# EAGLE design clock (EAGLE 7.3.0)
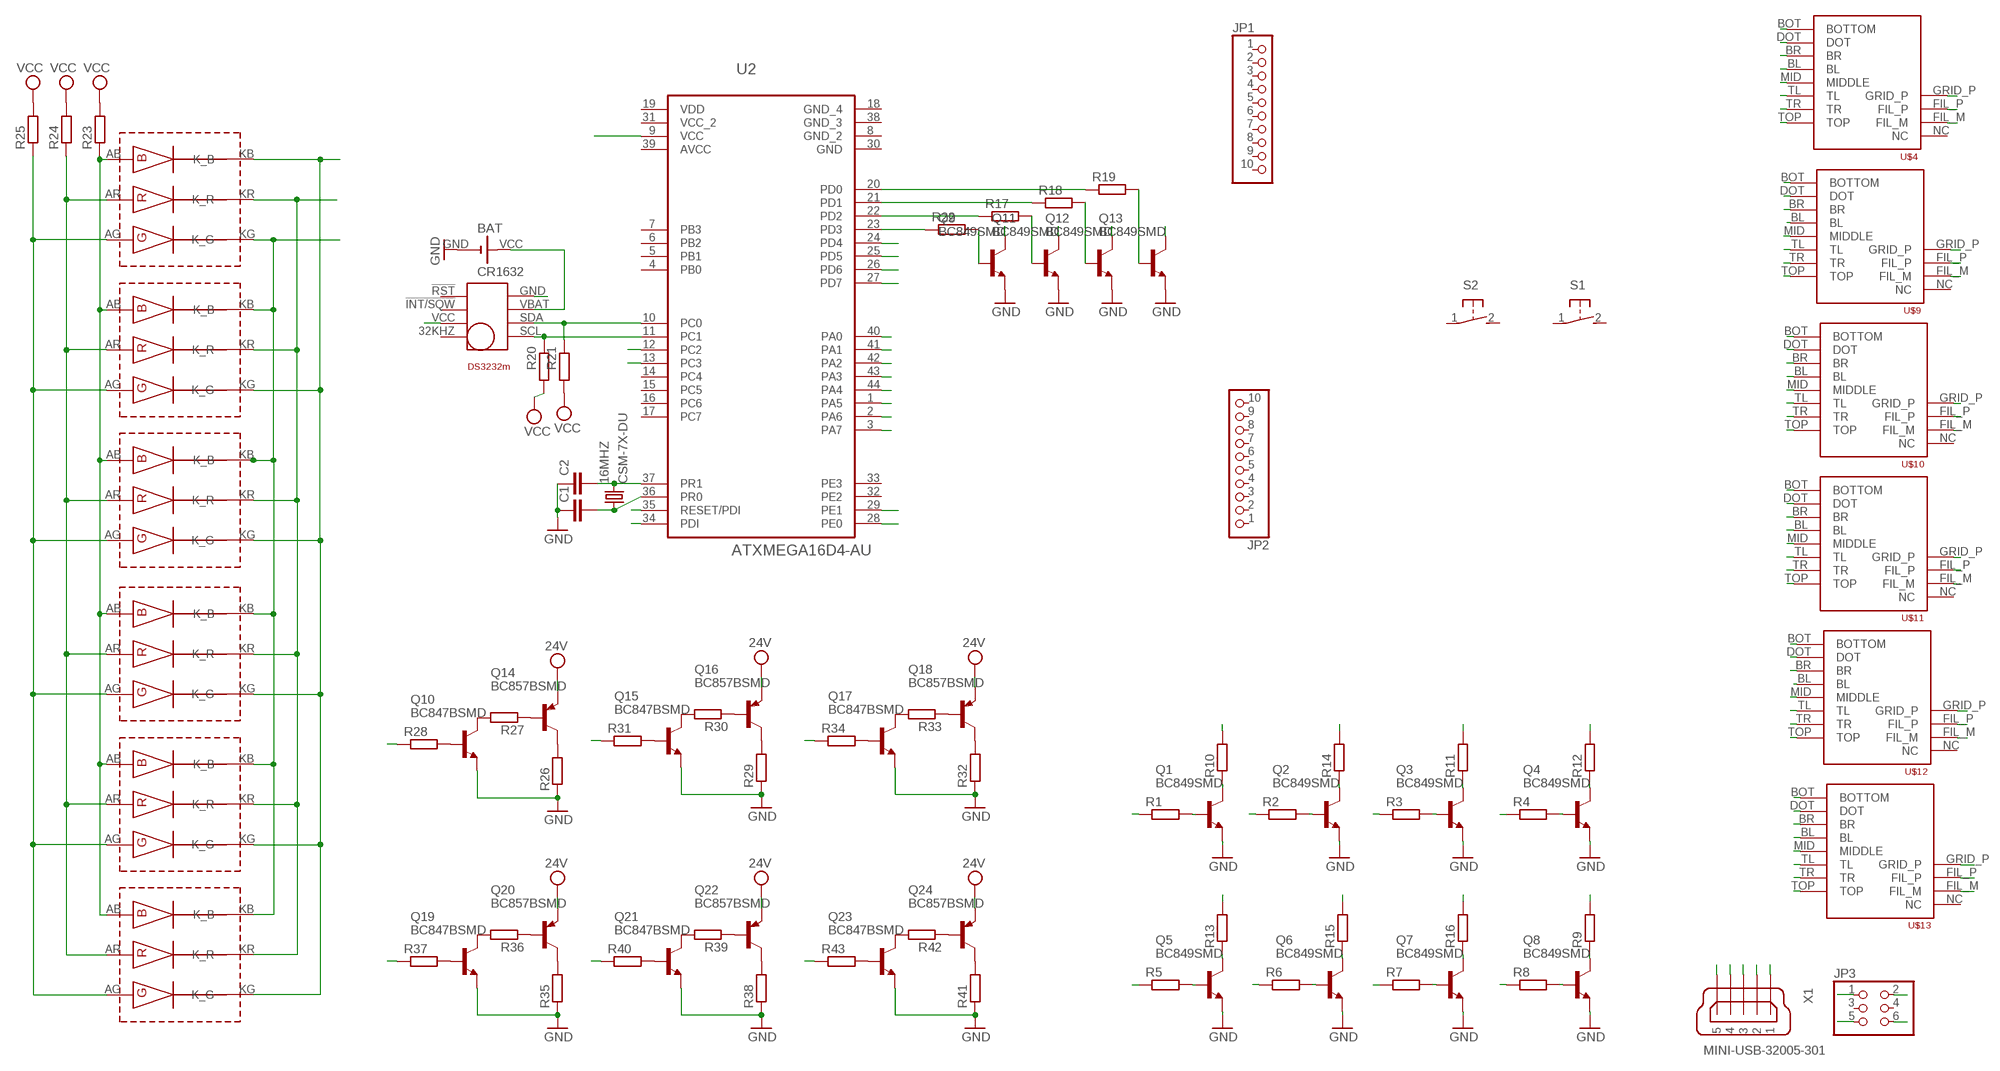
[diagram p0: schematic, sheet 1]

## Parts
16MHZ  CSM-7X-DU  [CSM-7X-DU]
BAT  CR1632  [CR3232]
C1  C-EUC0805K  [C0805K]
C2  C-EUC0805K  [C0805K]
JP1  PINHD-1X10  [1X10]
JP2  PINHD-1X10  [1X10]
JP3  PINHD-2X3/90  [2X03/90]
Q1  BC849SMD  [SOT23-BEC]
Q2  BC849SMD  [SOT23-BEC]
Q3  BC849SMD  [SOT23-BEC]
Q4  BC849SMD  [SOT23-BEC]
Q5  BC849SMD  [SOT23-BEC]
Q6  BC849SMD  [SOT23-BEC]
Q7  BC849SMD  [SOT23-BEC]
Q8  BC849SMD  [SOT23-BEC]
Q9  BC849SMD  [SOT23-BEC]
Q10  BC847BSMD  [SOT23]
Q11  BC849SMD  [SOT23-BEC]
Q12  BC849SMD  [SOT23-BEC]
Q13  BC849SMD  [SOT23-BEC]
Q14  BC857BSMD  [SOT23-BEC]
Q15  BC847BSMD  [SOT23]
Q16  BC857BSMD  [SOT23-BEC]
Q17  BC847BSMD  [SOT23]
Q18  BC857BSMD  [SOT23-BEC]
Q19  BC847BSMD  [SOT23]
Q20  BC857BSMD  [SOT23-BEC]
Q21  BC847BSMD  [SOT23]
Q22  BC857BSMD  [SOT23-BEC]
Q23  BC847BSMD  [SOT23]
Q24  BC857BSMD  [SOT23-BEC]
R1  R-EU_0207/10  [0207/10]
R2  R-EU_0207/10  [0207/10]
R3  R-EU_0207/10  [0207/10]
R4  R-EU_0207/10  [0207/10]
R5  R-EU_0207/10  [0207/10]
R6  R-EU_0207/10  [0207/10]
R7  R-EU_0207/10  [0207/10]
R8  R-EU_0207/10  [0207/10]
R9  R-EU_0207/10  [0207/10]
R10  R-EU_0207/10  [0207/10]
R11  R-EU_0207/10  [0207/10]
R12  R-EU_0207/10  [0207/10]
R13  R-EU_0207/10  [0207/10]
R14  R-EU_0207/10  [0207/10]
R15  R-EU_0207/10  [0207/10]
R16  R-EU_0207/10  [0207/10]
R17  R-EU_0207/10  [0207/10]
R18  R-EU_0207/10  [0207/10]
R19  R-EU_0207/10  [0207/10]
R20  R-EU_0207/10  [0207/10]
R21  R-EU_0207/10  [0207/10]
R22  R-EU_0207/10  [0207/10]
R23  R-EU_0207/10  [0207/10]
R24  R-EU_0207/10  [0207/10]
R25  R-EU_0207/10  [0207/10]
R26  R-EU_0207/10  [0207/10]
R27  R-EU_0207/10  [0207/10]
R28  R-EU_0207/10  [0207/10]
R29  R-EU_0207/10  [0207/10]
R30  R-EU_0207/10  [0207/10]
R31  R-EU_0207/10  [0207/10]
R32  R-EU_0207/10  [0207/10]
R33  R-EU_0207/10  [0207/10]
R34  R-EU_0207/10  [0207/10]
R35  R-EU_0207/10  [0207/10]
R36  R-EU_0207/10  [0207/10]
R37  R-EU_0207/10  [0207/10]
R38  R-EU_0207/10  [0207/10]
R39  R-EU_0207/10  [0207/10]
R40  R-EU_0207/10  [0207/10]
R41  R-EU_0207/10  [0207/10]
R42  R-EU_0207/10  [0207/10]
R43  R-EU_0207/10  [0207/10]
S1  31-XX  [B3F-31XX]
S2  31-XX  [B3F-31XX]
U2  ATXMEGA16D4-AU  [QFP80P1200X1200X120-44N]
U$1  RGB-SMT-SQUARE5X5MM  [SMT-SQUARE5]
U$2  DS3232M  [SOIC8]
U$3  RGB-SMT-SQUARE5X5MM  [SMT-SQUARE5]
U$4  IV6_NUMITRONLARGE  [IV6_NUMITRON_PAC_LARGE]
U$5  RGB-SMT-SQUARE5X5MM  [SMT-SQUARE5]
U$6  RGB-SMT-SQUARE5X5MM  [SMT-SQUARE5]
U$7  RGB-SMT-SQUARE5X5MM  [SMT-SQUARE5]
U$8  RGB-SMT-SQUARE5X5MM  [SMT-SQUARE5]
U$9  IV6_NUMITRONLARGE  [IV6_NUMITRON_PAC_LARGE]
U$10  IV6_NUMITRONLARGE  [IV6_NUMITRON_PAC_LARGE]
U$11  IV6_NUMITRONLARGE  [IV6_NUMITRON_PAC_LARGE]
U$12  IV6_NUMITRONLARGE  [IV6_NUMITRON_PAC_LARGE]
U$13  IV6_NUMITRONLARGE  [IV6_NUMITRON_PAC_LARGE]
X1  MINI-USB-32005-301  [32005-301]

## Nets
24V: Q14.E Q16.E Q18.E Q20.E Q22.E Q24.E
B: Q11.C U$1.KB(K_B) U$3.KG(K_G) U$5.KG(K_G) U$6.KG(K_G) U$7.KG(K_G) U$8.KG(K_G)
BL: U$4.BL U$9.BL U$10.BL U$11.BL U$12.BL U$13.BL
BOT: U$4.BOT(BOTTOM) U$9.BOT(BOTTOM) U$10.BOT(BOTTOM) U$11.BOT(BOTTOM) U$12.BOT(BOTTOM) U$13.BOT(BOTTOM)
BR: U$4.BR U$9.BR U$10.BR U$11.BR U$12.BR U$13.BR
DOT: U$4.DOT U$9.DOT U$10.DOT U$11.DOT U$12.DOT U$13.DOT
FIL_P: U$4.FIL_P U$9.FIL_P U$10.FIL_P U$11.FIL_P U$12.FIL_P U$13.FIL_P
FILL_MINUS: Q9.C
G: Q12.C U$1.KG(K_G) U$3.KB(K_B) U$5.KB(K_B) U$6.KB(K_B) U$7.KB(K_B) U$8.KB(K_B)
GND: BAT.GND(-) C1.1 C2.1 JP3.6 Q1.E Q2.E Q3.E Q4.E Q5.E Q6.E Q7.E Q8.E Q9.E Q10.2(E) Q11.E Q12.E Q13.E Q15.2(E) Q17.2(E) Q19.2(E) Q21.2(E) Q23.2(E) R26.1 R29.1 R32.1 R35.1 R38.1 R41.1 U$2.GND X1.1 X1.2
MID: U$4.MID(MIDDLE) U$9.MID(MIDDLE) U$10.MID(MIDDLE) U$11.MID(MIDDLE) U$12.MID(MIDDLE) U$13.MID(MIDDLE)
N$1: Q14.C R26.2
N$2: R10.2
N$3: Q14.B R27.1
N$4: Q16.C R29.2
N$5: 16MHZ.1 C1.2 U2.36(PR0)
N$6: R11.2
N$7: Q16.B R30.1
N$8: Q18.C R32.2
N$9: Q8.B R8.2
N$10: Q1.B R1.2
N$11: Q3.B R3.2
N$12: Q4.B R4.2
N$13: Q5.B R5.2
N$14: Q2.B R2.2
N$15: Q6.B R6.2
N$16: Q7.B R7.2
N$17: Q18.B R33.1
N$18: Q1.C R10.1
N$19: Q4.C R12.1
N$20: R12.2
N$21: Q5.C R13.1
N$22: Q2.C R14.1
N$23: R15.2
N$24: Q7.C R16.1
N$25: R20.1 U2.11(PC1) U$2.SCL
N$26: Q20.C R35.2
N$27: Q20.B R36.1
N$28: BAT.VCC(+) U$2.VBAT
N$29: Q9.B R22.2
N$30: Q22.C R38.2
N$31: Q10.3(C) R27.2
N$32: R22.1 U2.23(PD3)
N$33: R23.1 U$1.AB(ANODE_B) U$3.AB(ANODE_B) U$5.AB(ANODE_B) U$6.AB(ANODE_B) U$7.AB(ANODE_B) U$8.AB(ANODE_B)
N$34: R24.1 U$1.AR(ANODE_R) U$3.AR(ANODE_R) U$5.AR(ANODE_R) U$6.AR(ANODE_R) U$7.AR(ANODE_R) U$8.AR(ANODE_R)
N$35: R25.1 U$1.AG(ANODE_G) U$3.AG(ANODE_G) U$5.AG(ANODE_G) U$6.AG(ANODE_G) U$7.AG(ANODE_G) U$8.AG(ANODE_G)
N$36: R17.1 U2.22(PD2)
N$37: R18.1 U2.21(PD1)
N$38: R19.1 U2.20(PD0)
N$39: Q11.B R17.2
N$40: Q12.B R18.2
N$41: Q13.B R19.2
N$42: Q10.1(B) R28.2
N$43: Q15.3(C) R30.2
N$44: Q15.1(B) R31.2
N$45: Q22.B R39.1
N$46: Q17.3(C) R33.2
N$47: Q17.1(B) R34.2
N$48: Q24.C R41.2
N$49: Q19.3(C) R36.2
N$50: Q19.1(B) R37.2
N$51: Q24.B R42.1
N$52: Q21.3(C) R39.2
N$53: Q21.1(B) R40.2
N$54: U$4.FIL_M
N$55: Q23.3(C) R42.2
N$56: Q23.1(B) R43.2
N$57: R14.2
N$58: Q3.C R11.1
N$59: R13.2
N$60: Q6.C R15.1
N$61: R9.2
N$62: Q8.C R9.1
N$63: U$9.FIL_M
N$68: U$11.GRID_P
N$69: U$11.FIL_M
N$70: U$10.GRID_P
N$71: U$10.FIL_M
N$72: U$4.GRID_P
N$73: U$9.GRID_P
N$74: U$12.GRID_P
N$76: U$12.FIL_M
N$77: U$13.GRID_P
N$79: U$13.FIL_M
PA0: R1.1 U2.40(PA0)
PA1: R2.1 U2.41(PA1)
PA2: R3.1 U2.42(PA2)
PA3: R4.1 U2.43(PA3)
PA4: R5.1 U2.44(PA4)
PA5: R6.1 U2.1(PA5)
PA6: R7.1 U2.2(PA6)
PA7: R8.1 U2.3(PA7)
PD4: R28.1 U2.24(PD4)
PD5: R31.1 U2.25(PD5)
PD6: R34.1 U2.26(PD6)
PD7: R37.1 U2.27(PD7)
PDI: JP3.1 U2.34(PDI)
PE0: R40.1 U2.28(PE0)
PE1: R43.1 U2.29(PE1)
PR1: 16MHZ.2 C2.2 U2.37(PR1)
R: Q13.C U$1.KR(K_R) U$3.KR(K_R) U$5.KR(K_R) U$6.KR(K_R) U$7.KR(K_R) U$8.KR(K_R)
RESET: JP3.5 U2.35(RESET/PDI)
RX: U2.12(PC2) X1.4
SDA: R21.1 U2.10(PC0) U$2.SDA
TL: U$4.TL U$9.TL U$10.TL U$11.TL U$12.TL U$13.TL
TOP: U$4.TOP U$9.TOP U$10.TOP U$11.TOP U$12.TOP U$13.TOP
TR: U$4.TR U$9.TR U$10.TR U$11.TR U$12.TR U$13.TR
TX: U2.13(PC3) X1.3
UB: R16.2
VCC: JP3.2 R20.2 R21.2 R23.2 R24.2 R25.2 U2.9(VCC) U$2.VCC X1.5
Unconnected: JP1.1 JP1.2 JP1.3 JP1.4 JP1.5 JP1.6 JP1.7 JP1.8 JP1.9 JP1.10 JP2.1 JP2.2 JP2.3 JP2.4 JP2.5 JP2.6 JP2.7 JP2.8 JP2.9 JP2.10 JP3.3 JP3.4 S1.1(P) S1.2(S) S2.1(P) S2.2(S) U2.4(PB0) U2.5(PB1) U2.6(PB2) U2.7(PB3) U2.8(GND_2) U2.14(PC4) U2.15(PC5) U2.16(PC6) U2.17(PC7) U2.18(GND_4) U2.30(GND) U2.32(PE2) U2.33(PE3) U2.38(GND_3) U$2.32KHZ U$2.!INT/!!SQW U$2.!RST U$4.NC U$9.NC U$10.NC U$11.NC U$12.NC U$13.NC

## Power pins joined to a net without a drawn wire
AVCC: U2.39(AVCC)
VCC_2: U2.31(VCC_2)
VDD: U2.19(VDD)

## Library data of the parts
16MHZ = quarz:CSM-7X-DU: SMD CRYSTAL Source: www.ecsxtal.com .. Crystal 3.6864MHz CSM_7X_DU.PDF; OC_FARNELL: unknown; OC_NEWARK: unknown
BAT = battery:CR1632
C1 C2 = rcl:C-EU: CAPACITOR, European symbol
JP1 JP2 = pinhead:PINHD-1X10: PIN HEADER
JP3 = pinhead:PINHD-2X3: PIN HEADER
Q1-Q9 Q11-Q13 = transistor-npn:BC849*: NPN Transistor
Q10 Q15 Q17 Q19 Q21 Q23 = transistor-npn:BC847*: NPN Transistor
Q14 Q16 Q18 Q20 Q22 Q24 = transistor-pnp:BC857*: PNP Transistror
R1-R43 = rcl:R-EU_: RESISTOR, European symbol
S1 S2 = switch-omron:31-XX: OMRON SWITCH; MPN: B3F-3100; OC_FARNELL: 959704; OC_NEWARK: 36M3582
U2 = atxmega16d4au:ATXMEGA16D4-AU: 8/16-bit Atmel XMEGA D4 Microcontroller; MPN: ATXMEGA16D4-AU; OC_FARNELL: 1748553; OC_NEWARK: 68T3906; PACKAGE: TQFP-44; SUPPLIER: ATMEL
U$1 U$3 U$5-U$8 = kalshagar:RGB-SMT-SQUARE: A simple SMD RGB led square in about 6x6.6mm. Different models possible, be careful of the pinout (can be interverted so annotate your schema) Sold here http://akizukidenshi.com/catalog/g/gI-02225/
U$2 = DS3232M:DS3232M
U$4 U$9-U$13 = kalshagar:IV6_NUMITRON: Regular version with small footprint
X1 = con-cypressindustries:MINI-USB-: MINI USB-B Conector Source: www.cypressindustries.com; OC_FARNELL: unknown; OC_NEWARK: unknown

## Net classes
0 default: width 0.406 mm, drill 0.406 mm, clearance 0.406 mm

## Board
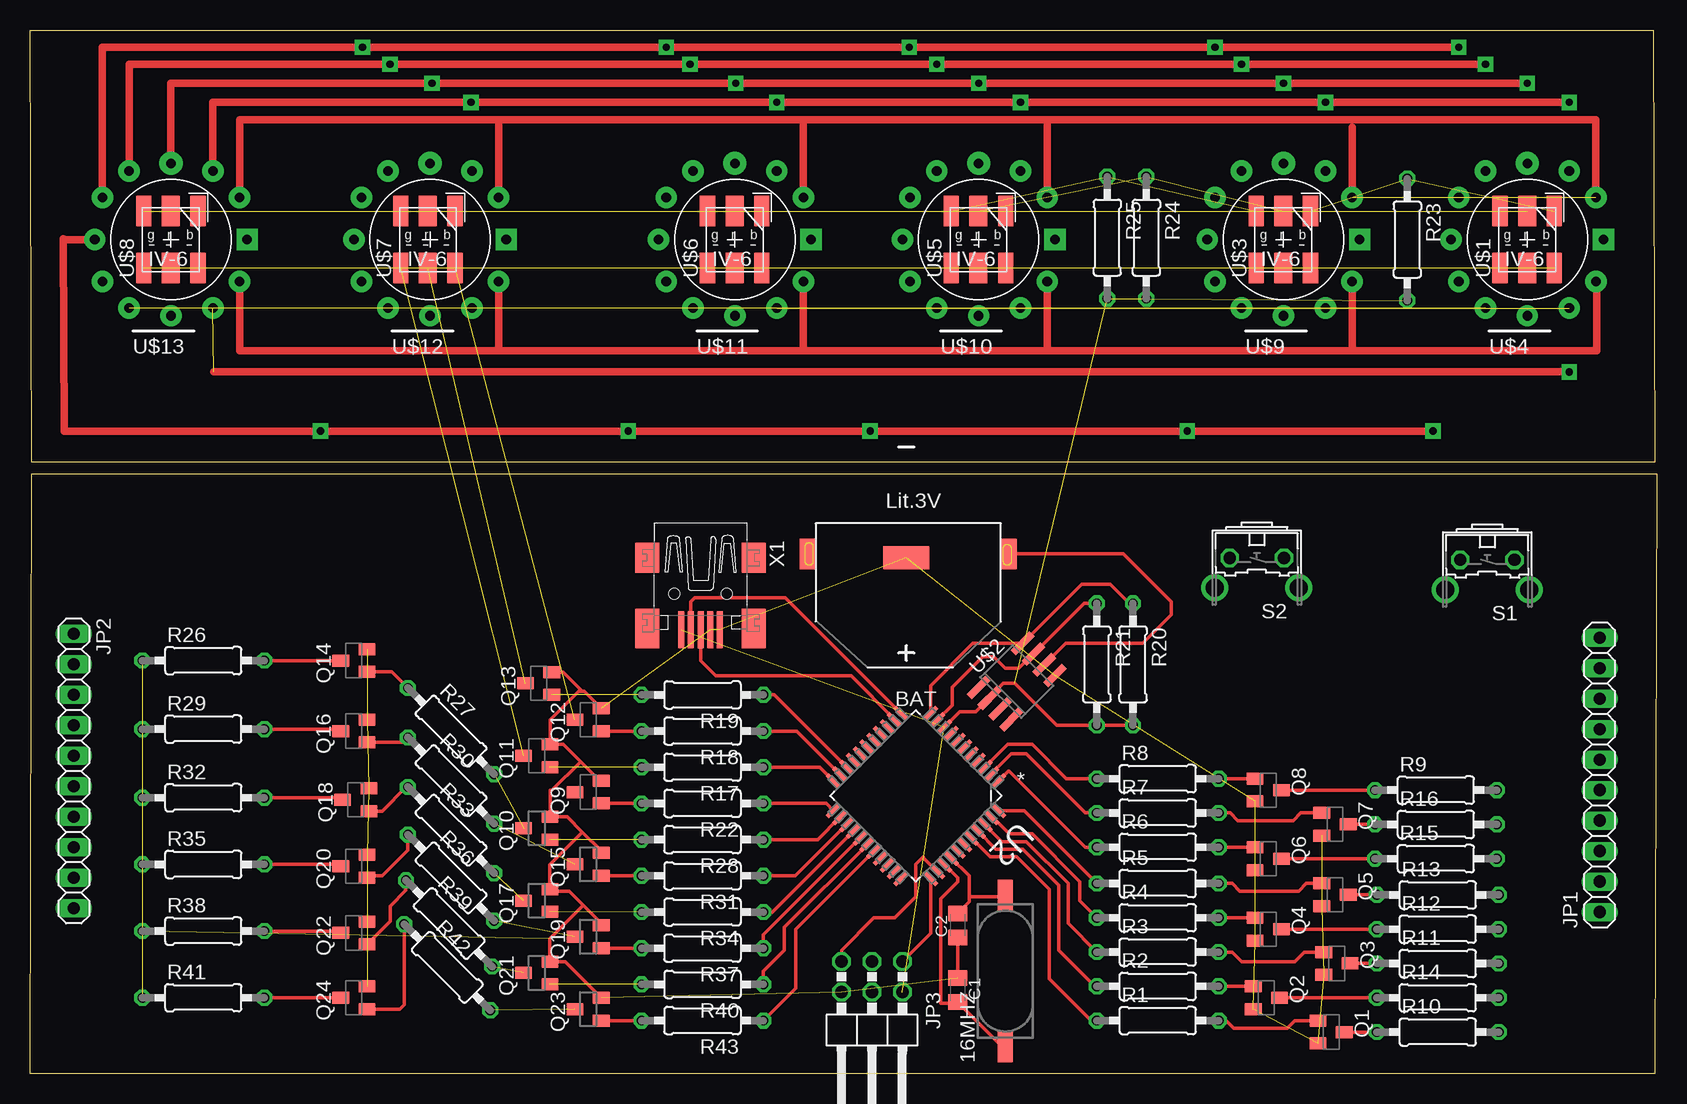
[diagram p1: board, top side]
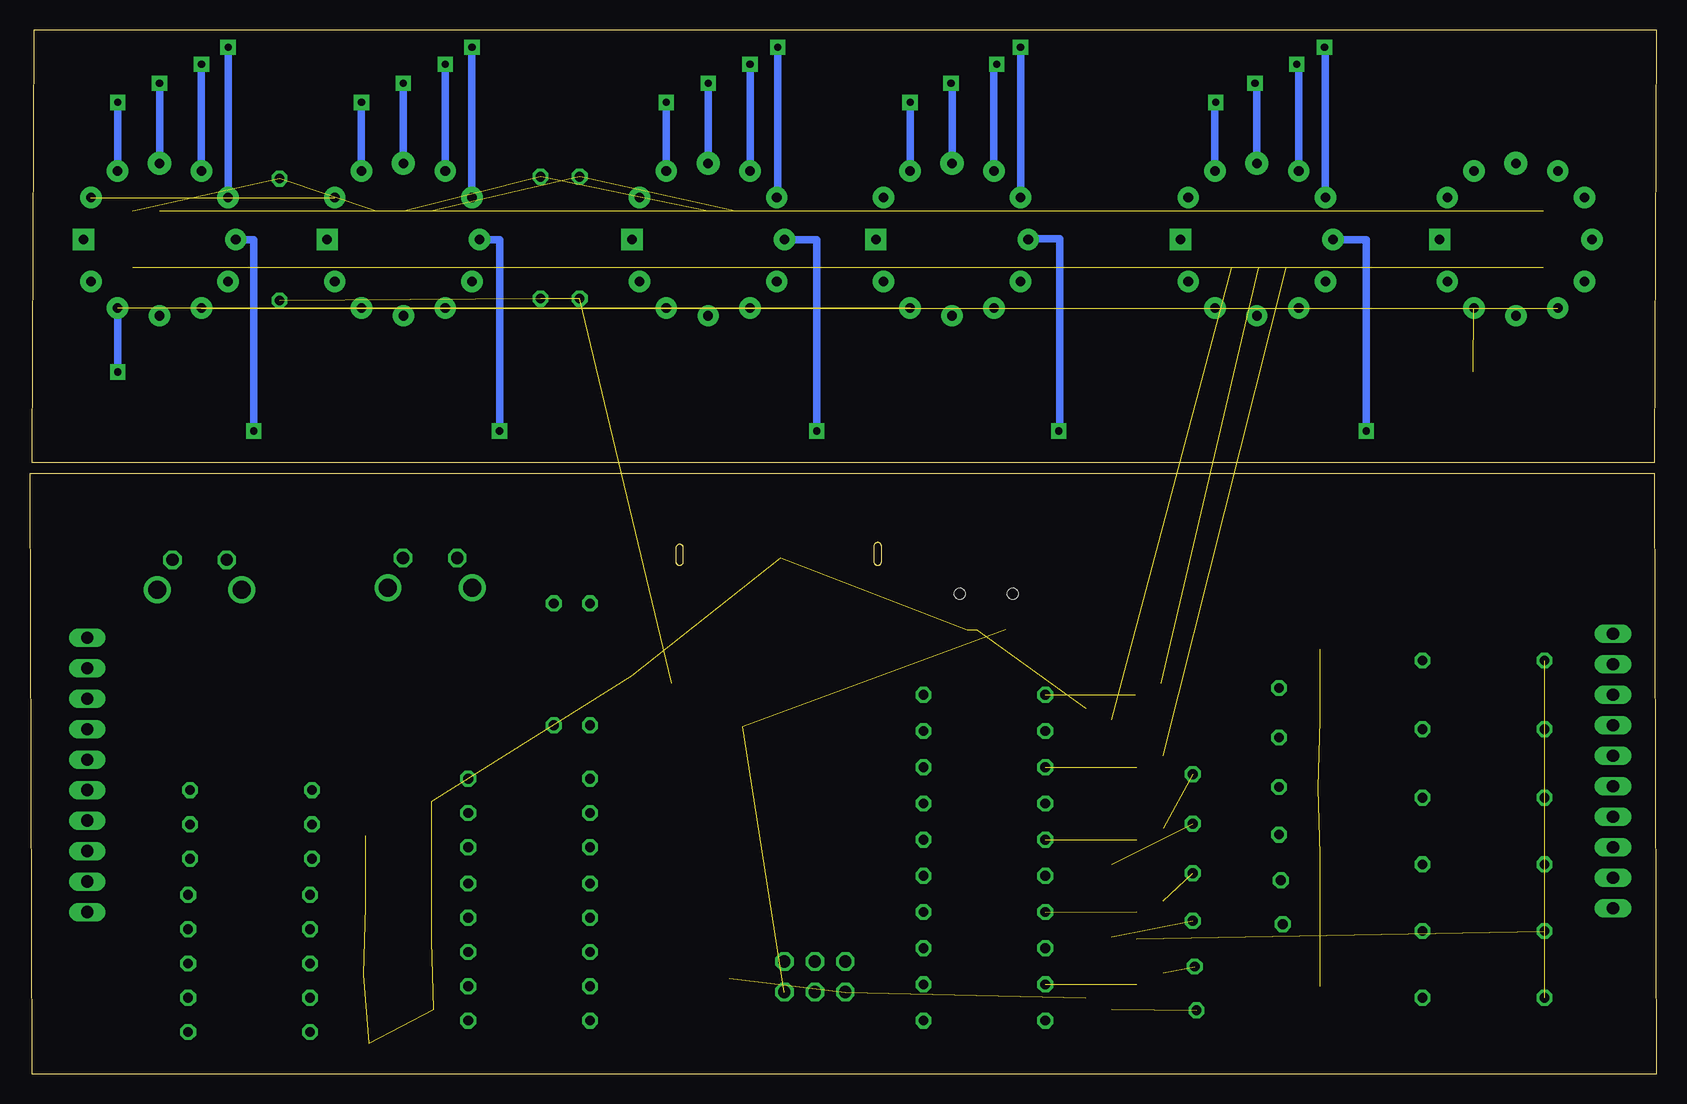
[diagram p2: board, bottom side, seen from below]

Size 135.57 x 87 mm. Coordinates in mm from the lower left corner, seen from the top.
Outline: 0.16,50.01 135.57,50.01 135.41,0 0,0 0.16,50.01
Outline: 0,86.99 135.25,86.99 135.41,50.96 0.16,50.96 0,86.99
Copper layers (1*16): Top 0.035mm / dielectric 1.5mm / Bottom 0.035mm
Design rules "default": minimum track width 10mil, minimum drill 24mil, track to track 8mil, track to pad 8mil, pad to pad 8mil, via to via 8mil, smd to smd 8mil, copper to edge 40mil, drill to drill 8mil, minimum pad ring 10mil, minimum via ring 8mil, stop-mask expansion 4mil, vias tented up to drill 0mil, thermal gap 10mil

### Footprints (pad centres in the part's own frame; a part is rotated, then mirrored left to right if it is on the bottom)
CSM-7X-DU = smd 2.54 x 1.27: 1 -6.338,0; 2 6.338,0
CR3232 = smd 3.81 x 1.93: GND 0,-0.953 | smd 1.27 x 2.54: VCC -8.572,-1.27; VCC1 8.255,-1.27
C0805K = smd 1.3 x 1.6: 1 -1,0; 2 1,0
1X10 = drill 1.016 long: 1 -11.43,0; 2 -8.89,0; 3 -6.35,0; 4 -3.81,0; 5 -1.27,0; 6 1.27,0; 7 3.81,0; 8 6.35,0; 9 8.89,0; 10 11.43,0
2X03/90 = drill 1.016 octagon: 1 -2.54,-6.35; 2 -2.54,-3.81; 3 0,-6.35; 4 0,-3.81; 5 2.54,-6.35; 6 2.54,-3.81
SOT23-BEC = smd 1 x 1.4: B -0.95,-1.1; C 0,1.1; E 0.95,-1.1
SOT23 = smd 1 x 1.4: 1 -0.95,-1.1; 2 0.95,-1.1; 3 0,1.1
0207/10 = drill 0.813 octagon: 1 -5.08,0; 2 5.08,0
B3F-31XX = drill 1.016 octagon: 1 -2.261,-1.245; 2 2.261,-1.245 | drill 1.499 pad 2.159: 3 -3.505,1.245; 4 3.505,1.245
QFP80P1200X1200X120-44N = smd 1.473 x 0.356: 1 -5.74,3.988; 2 -5.74,3.2; 3 -5.74,2.388; 4 -5.74,1.6; 5 -5.74,0.787; 6 -5.74,0; 7 -5.74,-0.787; 8 -5.74,-1.6; 9 -5.74,-2.388; 10 -5.74,-3.2; 11 -5.74,-3.988; 23 5.74,-3.988; 24 5.74,-3.2; 25 5.74,-2.388; 26 5.74,-1.6; 27 5.74,-0.787; 28 5.74,0; 29 5.74,0.787; 30 5.74,1.6; 31 5.74,2.388; 32 5.74,3.2; 33 5.74,3.988 | smd 0.356 x 1.473: 12 -3.988,-5.74; 13 -3.2,-5.74; 14 -2.388,-5.74; 15 -1.6,-5.74; 16 -0.787,-5.74; 17 0,-5.74; 18 0.787,-5.74; 19 1.6,-5.74; 20 2.388,-5.74; 21 3.2,-5.74; 22 3.988,-5.74; 34 3.988,5.74; 35 3.2,5.74; 36 2.388,5.74; 37 1.6,5.74; 38 0.787,5.74; 39 0,5.74; 40 -0.787,5.74; 41 -1.6,5.74; 42 -2.388,5.74; 43 -3.2,5.74; 44 -3.988,5.74
SMT-SQUARE5 = smd 1.27 x 2.54: AB 4.628,4.905; AG 0.102,4.905; KB 4.628,0.175; KG 0.102,0.175 | smd 1.5 x 2.54: AR 2.365,4.905; KR 2.365,0.175
SOIC8 = smd 0.6 x 2.2: 32KHZ -1.905,-2.6; !INT/!!SQW 0.635,-2.6; !RST 1.905,-2.6; GND 1.905,2.6; SCL -1.905,2.6; SDA -0.635,2.6; VBAT 0.635,2.6; VCC -0.635,-2.6
IV6_NUMITRON_PAC_LARGE = drill 0.8 pad 1.778: BL -5.715,3.493; BOT -6.35,0; BR 3.493,-5.715; DOT 5.715,-3.493; FIL_M -5.715,-3.493; FIL_P -3.493,-5.715; GRID_P 0,-6.35; TL -3.493,5.715; TOP 3.493,5.715; TR 5.715,3.493 | drill 0.8 pad 1.93: MID 0,6.35 | drill 0.8 pad 1.778 square: NC 6.35,0
32005-301 = smd 3.1 x 0.5: 1 3,1.6; 2 3,0.8; 3 3,0; 4 3,-0.8; 5 3,-1.6 | smd 2.5 x 2: M1 -3,-4.45; M2 -3,4.45 | smd 3.3 x 2: M3 2.9,4.45; M4 2.9,-4.45 | hole 0.9: 0,2.2; 0,-2.2

### Placement (x,y rotation side)
16MHZ  81.28,8.57 90 top
BAT  73.02,42.07 180 top
C1  77.31,6.99 270 top
C2  77.31,12.38 90 top
JP1  130.81,24.92 90 top
JP2  3.65,25.24 270 top
JP3  70.17,3.02 180 top
Q1  108.43,3.49 270 top
Q2  103.03,6.35 270 top
Q3  108.9,9.21 270 top
Q4  103.19,12.07 270 top
Q5  108.74,14.92 270 top
Q6  103.19,17.94 270 top
Q7  108.74,20.8 270 top
Q8  103.19,23.65 270 top
Q9  46.51,23.5 90 top
Q10  42.23,20.48 90 top
Q11  42.23,26.51 90 top
Q12  46.51,29.53 90 top
Q13  42.39,32.54 90 top
Q14  26.99,34.45 90 top
Q15  46.51,17.46 90 top
Q16  26.99,28.58 90 top
Q17  42.23,14.45 90 top
Q18  27.15,22.86 90 top
Q19  46.51,11.43 90 top
Q20  26.99,17.3 90 top
Q21  42.23,8.41 90 top
Q22  26.99,11.75 90 top
Q23  46.51,5.4 90 top
Q24  26.99,6.35 90 top
R1  93.98,4.45 0 top
R2  93.98,7.3 0 top
R3  93.98,10.16 0 top
R4  93.98,13.02 0 top
R5  93.98,15.88 0 top
R6  93.98,18.89 0 top
R7  93.98,21.75 0 top
R8  93.98,24.61 0 top
R9  117.16,23.65 0 top
R10  117.32,3.49 0 top
R11  117.32,9.21 0 top
R12  117.32,12.07 0 top
R13  117.32,14.92 0 top
R14  117.32,6.35 0 top
R15  117.16,17.94 0 top
R16  117.16,20.8 0 top
R17  56.04,25.56 180 top
R18  56.04,28.58 180 top
R19  56.04,31.59 180 top
R20  91.92,34.13 270 top
R21  88.9,34.13 270 top
R22  56.04,22.54 180 top
R23  114.78,69.53 270 top
R24  93.03,69.69 270 top
R25  89.77,69.69 270 top
R26  14.45,34.45 0 top
R27  35.08,28.58 315 top
R28  56.04,19.53 180 top
R29  14.45,28.73 0 top
R30  35.08,24.45 315 top
R31  56.04,16.51 180 top
R32  14.45,23.02 0 top
R33  35.08,20.32 315 top
R34  56.04,13.49 180 top
R35  14.45,17.46 0 top
R36  35.08,16.35 315 top
R37  56.04,10.48 180 top
R38  14.45,11.91 0 top
R39  34.92,12.54 315 top
R40  56.04,7.46 180 top
R41  14.45,6.35 0 top
R42  34.77,8.89 315 top
R43  56.04,4.45 180 top
S1  121.44,41.59 180 top
S2  102.23,41.75 180 top
U2  73.82,23.18 225 top
U$1  122.4,66.99 0 top
U$2  82.23,32.7 315 top
U$3  102.08,66.99 0 top
U$4  124.78,69.53 0 top
U$5  76.68,66.99 0 top
U$6  56.36,66.99 0 top
U$7  30.8,66.99 0 top
U$8  9.37,66.99 0 top
U$9  104.46,69.53 0 top
U$10  79.06,69.53 0 top
U$11  58.74,69.53 0 top
U$12  33.34,69.53 0 top
U$13  11.75,69.53 0 top
X1  55.88,40.01 270 top

### Tracks (layer width: path | path; a pad name or v marks a point on that pad's centre or on a via)
24V  (5 unrouted)
B  (6 unrouted)
BL  (via drill 0.6 pad 1.27)
  Top 0.61: U$13.BL 6.03,85.57 v27.7,85.57 v53.02,85.57 v73.26,85.57 v98.74,85.57 v119.06,85.57
  Bottom 0.61: U$4.BL v119.06,85.57 | U$9.BL v98.74,85.57 | U$11.BL v53.02,85.57 | U$12.BL 27.62,85.49 v27.7,85.57 | U$10.BL 73.26,73.02 v73.26,85.57
BOT  (via drill 0.6 pad 1.27)
  Top 0.61: U$13.BOT 2.86,69.53 2.78,69.61 2.86,53.58 v24.21,53.58 v49.85,53.58 v70.01,53.58 v96.44,53.58 v116.92,53.58
  Bottom 0.61: U$12.BOT 24.21,69.53 v24.21,53.58 | U$11.BOT 52.39,69.61 49.77,69.61 49.77,53.58 v49.85,53.58 | U$10.BOT 70.01,69.53 v70.01,53.58 | U$9.BOT 96.44,69.53 v96.44,53.58 | U$4.BOT 116.92,69.53 v116.92,53.58
BR  (via drill 0.6 pad 1.27)  (5 unrouted)
  Top 0.61: v128.27,58.5 15.32,58.5
  Bottom 0.61: U$4.BR v128.27,58.5
DOT
  Top 0.61: U$13.DOT 17.46,60.25 38.97,60.25 39.05,60.25 | 39.05,60.25 64.45,60.25 | 64.45,60.25 84.77,60.25 | 84.77,60.25 110.17,60.25 | 110.17,60.25 130.57,60.25 130.57,66.04 U$4.DOT | U$9.DOT 110.17,60.25 | U$10.DOT 84.77,60.25 | U$11.DOT 64.45,60.25 | U$12.DOT 39.05,60.25
FIL_P  (5 unrouted)
G  (6 unrouted)
GND  (20 unrouted)
  Top 0.305: Q15.2 47.61,18.58 46.04,20.16 | 46.04,20.16 44.77,21.43 43.34,21.43 | 43.34,21.43 Q10.2 | 46.04,20.16 43.33,17.45 Q17.2 43.48,15.24 44.93,15.24 46.12,14.05 | Q19.2 47.61,12.55 46.12,14.05 | 46.12,14.05 43.33,11.26 Q21.2 44.6,9.36 Q23.2 | Q9.E 47.47,24.44 45.88,26.03 | 45.88,26.03 44.45,27.46 Q11.E 43.34,27.47 43.34,29.53 45.72,31.91 46.04,31.91 | 43.34,21.43 43.34,23.65 43.5,23.65 45.88,26.03 | Q13.E 44.45,33.49 46.04,31.91 | 46.04,31.91 46.18,31.91 Q12.E | C2.1 C1.1
MID  (via drill 0.6 pad 1.27)
  Top 0.61: U$13.MID 11.75,82.55 v33.5,82.55 v58.82,82.55 v79.06,82.55 v104.46,82.55 v124.78,82.55
  Bottom 0.61: U$4.MID v124.78,82.55 | U$9.MID v104.46,82.55 | U$10.MID v79.06,82.55 | U$11.MID 58.74,82.47 v58.82,82.55 | U$12.MID 33.34,82.39 v33.5,82.55
N$1
  Top 0.305: R26.2 Q14.C
N$3
  Top 0.305: Q14.B 30.16,33.5 R27.1
N$4
  Top 0.305: R29.2 25.73,28.73 Q16.C
N$5
  Top 0.305: U2.36 76.23,17.43 77.31,16.35 77.31,16.03 75.88,14.6 75.88,5.87 77.2,5.87 C1.2 81.06,2.23 16MHZ.1
N$7
  Top 0.305: Q16.B 31.08,27.62 R30.1
N$8
  Top 0.305: R32.2 25.89,23.02 Q18.C
N$9
  Top 0.305: R8.2 Q8.B
N$10
  Top 0.305: R1.2 99.69,4.44 100.33,3.81 104.78,3.81 105.41,4.44 Q1.B
N$11
  Top 0.305: R3.2 100.17,10.16 100.96,9.37 105.41,9.37 106.2,10.16 Q3.B
N$12
  Top 0.305: R4.2 Q4.B
N$13
  Top 0.305: R5.2 100.17,15.87 100.81,15.24 105.73,15.24 106.36,15.87 Q5.B
N$14
  Top 0.305: R2.2 Q2.B
N$15
  Top 0.305: R6.2 Q6.B
N$16
  Top 0.305: R7.2 100.01,21.75 100.65,21.11 105.25,21.11 105.89,21.75 Q7.B
N$17
  Top 0.305: R33.1 31.37,23.91 29.37,21.91 Q18.B
N$18
  Top 0.305: Q1.C R10.1
N$19
  Top 0.305: Q4.C R12.1
N$21
  Top 0.305: Q5.C R13.1
N$22
  Top 0.305: Q2.C R14.1
N$24
  Top 0.305: Q7.C R16.1
N$25
  Top 0.305: R20.1 91.6,39.21 90.01,40.8 87.63,40.8 U$2.SCL 82.71,35.88 78.58,35.88 75.06,32.35 U2.11
N$26
  Top 0.305: R35.2 25.73,17.46 Q20.C
N$27
  Top 0.305: R36.1 31.49,18.63 29.37,16.51 28.24,16.51 Q20.B
N$28
  Top 0.305: BAT.VCC 91.12,43.34 95.09,39.37 95.09,38.26 92.71,35.88 86.31,35.88 U$2.VBAT
N$29
  Top 0.305: Q9.B R22.2
N$30
  Top 0.305: R38.2 25.73,11.91 Q22.C
N$31  (1 unrouted)
N$32
  Top 0.305: R22.1 66.34,22.54 U2.23
N$33  (6 unrouted)
N$34  (6 unrouted)
N$35  (6 unrouted)
N$36
  Top 0.305: R17.1 65.8,25.56 U2.22
N$37
  Top 0.305: R18.1 63.9,28.57 U2.21
N$38
  Top 0.305: R19.1 62.03,31.59 U2.20
N$39  (1 unrouted)
N$40
  Top 0.305: Q12.B R18.2
N$41  (1 unrouted)
  Top 0.305: R19.2
N$42  (1 unrouted)
N$43  (1 unrouted)
N$44
  Top 0.305: Q15.1 R31.2
N$45
  Top 0.305: R39.1 31.33,15.3 30,13.97 30,12.71 Q22.B
N$46  (1 unrouted)
N$47  (1 unrouted)
N$48
  Top 0.305: R41.2 Q24.C
N$49  (1 unrouted)
N$50
  Top 0.305: Q19.1 R37.2
N$51
  Top 0.305: R42.1 31.17,5.77 30.8,5.4 Q24.B
N$52  (1 unrouted)
N$53  (1 unrouted)
N$55  (1 unrouted)
N$56
  Top 0.305: Q23.1 R43.2
N$58
  Top 0.305: Q3.C R11.1
N$60
  Top 0.305: Q6.C R15.1
N$62
  Top 0.305: Q8.C R9.1
PA0
  Top 0.305: U2.40 80.01,18.1 82.23,18.1 84.93,15.4 84.93,7.94 88.42,4.44 R1.1
PA1
  Top 0.305: U2.41 79.01,20.21 80.49,18.73 82.71,18.73 85.72,15.72 85.72,10.32 88.74,7.3 R2.1
PA2
  Top 0.305: U2.42 79.57,20.76 80.96,19.37 83.03,19.37 86.52,15.87 86.52,12.54 R3.1
PA3
  Top 0.305: U2.43 80.22,21.38 81.6,20 83.5,20 87.47,16.03 87.47,14.45 R4.1
PA4
  Top 0.305: U2.44 82.84,21.94 R5.1
PA5
  Top 0.305: R6.1 87.95,18.89 81.6,25.24 81.52,25.24 U2.1
PA6
  Top 0.305: U2.2 80.14,25.05 81.76,26.67 83.03,26.67 87.95,21.75 R7.1
PA7
  Top 0.305: R8.1 86.36,24.61 83.5,27.46 81.48,27.46 U2.3
PD4
  Top 0.305: R28.1 65.64,19.53 U2.24
PD5
  Top 0.305: R31.1 63.77,16.51 U2.25
PD6
  Top 0.305: R34.1 61.87,13.49 U2.26
PD7
  Top 0.305: R37.1 61.12,11.59 U2.27
PDI
  Top 0.305: U2.34 75.06,11.72 JP3.1
PE0
  Top 0.305: R40.1 61.12,8.57 62.86,10.32 62.86,12.22 U2.28
PE1
  Top 0.305: U2.29 63.82,12.06 63.82,7.14 R43.1
PR1
  Top 0.305: U2.37 76.79,17.99 78.26,16.51 78.26,14.76 | 78.26,14.76 81.13,14.76 16MHZ.2 | 78.26,14.76 78.26,14.33 C2.2
R  (6 unrouted)
RESET
  Top 0.305: JP3.5 67.63,10.32 70.33,13.02 72.07,13.02 73.82,14.76 73.82,17.46 74.45,18.1 74.45,18.02 U2.35
RX
  Top 0.305: X1.4 55.08,39.36 55.4,39.69 62.95,39.69 U2.12
SDA
  Top 0.305: R21.1 87.84,39.21 U$2.SDA 83.57,34.99 82.39,33.81 81.28,33.81 80.33,34.77 79.38,34.77 76.84,32.23 76.84,30.72 U2.10
TL  (via drill 0.6 pad 1.27)
  Top 0.61: U$13.TL 8.25,84.14 v30,84.14 v55.01,84.14 v75.57,84.14 v100.96,84.14 v121.29,84.14
  Bottom 0.61: U$4.TL v121.29,84.14 | U$9.TL v100.96,84.14 | U$12.TL 29.85,83.98 v30,84.14 | U$11.TL 55.25,83.9 v55.01,84.14 | U$10.TL v75.57,84.14
TOP  (via drill 0.6 pad 1.27)
  Top 0.61: U$13.TOP 15.24,80.96 v36.75,80.96 v62.23,80.96 v82.55,80.96 v107.95,80.96 v128.27,80.96
  Bottom 0.61: U$4.TOP v128.27,80.96 | U$10.TOP v82.55,80.96 | U$11.TOP v62.23,80.96 | U$12.TOP 36.83,80.88 v36.75,80.96 | U$9.TOP v107.95,80.96
TR  (1 unrouted)
  Top 0.61: U$13.TR 17.46,79.53 39.05,79.53 | 39.05,79.53 64.45,79.53 | 64.45,79.53 84.77,79.53 | 84.77,79.53 130.49,79.53 U$4.TR | U$12.TR 39.05,79.53 | U$9.TR 110.17,78.9 | U$11.TR 64.45,79.53 | U$10.TR 84.77,79.53
TX
  Top 0.305: U2.13 72.02,29.58 68.42,33.18 57.15,33.18 55.88,34.45 X1.3
VCC  (5 unrouted)
  Top 0.305: U2.9 76.23,28.92 77.47,30.16 78.79,30.16 U$2.VCC 79.95,31.37 81.12,32.54 82.07,32.54 85.57,29.05 R21.2 R20.2